# Altium schematic sheet PART1_filters.SchDoc: PART1_RC_filters
size A4
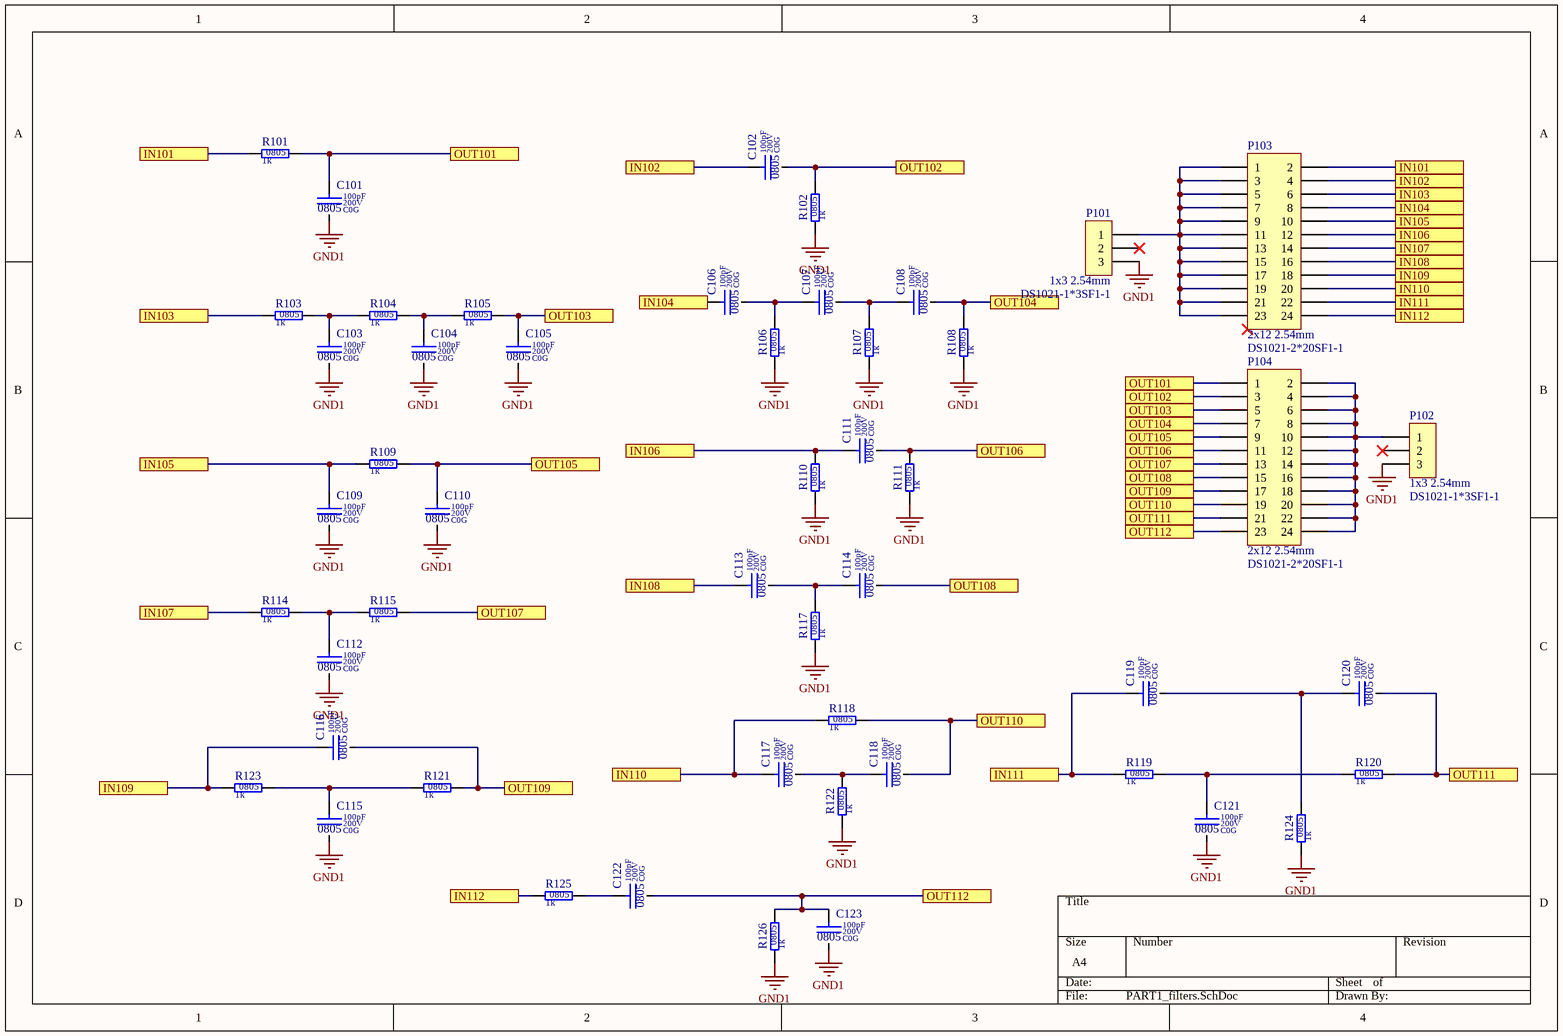
[diagram p0: PART1_filters.SchDoc]

## Parts
C101  value 100pF  Dielectric: C0G  Voltage: 200V  SCH_Footprint: 0805  [C_0805_2012]  (hidden comment: Ceramic C0G)
C102  value 100pF  Dielectric: C0G  Voltage: 200V  SCH_Footprint: 0805  [C_0805_2012]  (hidden comment: Ceramic C0G)
C103  value 100pF  Dielectric: C0G  Voltage: 200V  SCH_Footprint: 0805  [C_0805_2012]  (hidden comment: Ceramic C0G)
C104  value 100pF  Dielectric: C0G  Voltage: 200V  SCH_Footprint: 0805  [C_0805_2012]  (hidden comment: Ceramic C0G)
C105  value 100pF  Dielectric: C0G  Voltage: 200V  SCH_Footprint: 0805  [C_0805_2012]  (hidden comment: Ceramic C0G)
C106  value 100pF  Dielectric: C0G  Voltage: 200V  SCH_Footprint: 0805  [C_0805_2012]  (hidden comment: Ceramic C0G)
C107  value 100pF  Dielectric: C0G  Voltage: 200V  SCH_Footprint: 0805  [C_0805_2012]  (hidden comment: Ceramic C0G)
C108  value 100pF  Dielectric: C0G  Voltage: 200V  SCH_Footprint: 0805  [C_0805_2012]  (hidden comment: Ceramic C0G)
C109  value 100pF  Dielectric: C0G  Voltage: 200V  SCH_Footprint: 0805  [C_0805_2012]  (hidden comment: Ceramic C0G)
C110  value 100pF  Dielectric: C0G  Voltage: 200V  SCH_Footprint: 0805  [C_0805_2012]  (hidden comment: Ceramic C0G)
C111  value 100pF  Dielectric: C0G  Voltage: 200V  SCH_Footprint: 0805  [C_0805_2012]  (hidden comment: Ceramic C0G)
C112  value 100pF  Dielectric: C0G  Voltage: 200V  SCH_Footprint: 0805  [C_0805_2012]  (hidden comment: Ceramic C0G)
C113  value 100pF  Dielectric: C0G  Voltage: 200V  SCH_Footprint: 0805  [C_0805_2012]  (hidden comment: Ceramic C0G)
C114  value 100pF  Dielectric: C0G  Voltage: 200V  SCH_Footprint: 0805  [C_0805_2012]  (hidden comment: Ceramic C0G)
C115  value 100pF  Dielectric: C0G  Voltage: 200V  SCH_Footprint: 0805  [C_0805_2012]  (hidden comment: Ceramic C0G)
C116  value 100pF  Dielectric: C0G  Voltage: 200V  SCH_Footprint: 0805  [C_0805_2012]  (hidden comment: Ceramic C0G)
C117  value 100pF  Dielectric: C0G  Voltage: 200V  SCH_Footprint: 0805  [C_0805_2012]  (hidden comment: Ceramic C0G)
C118  value 100pF  Dielectric: C0G  Voltage: 200V  SCH_Footprint: 0805  [C_0805_2012]  (hidden comment: Ceramic C0G)
C119  value 100pF  Dielectric: C0G  Voltage: 200V  SCH_Footprint: 0805  [C_0805_2012]  (hidden comment: Ceramic C0G)
C120  value 100pF  Dielectric: C0G  Voltage: 200V  SCH_Footprint: 0805  [C_0805_2012]  (hidden comment: Ceramic C0G)
C121  value 100pF  Dielectric: C0G  Voltage: 200V  SCH_Footprint: 0805  [C_0805_2012]  (hidden comment: Ceramic C0G)
C122  value 100pF  Dielectric: C0G  Voltage: 200V  SCH_Footprint: 0805  [C_0805_2012]  (hidden comment: Ceramic C0G)
C123  value 100pF  Dielectric: C0G  Voltage: 200V  SCH_Footprint: 0805  [C_0805_2012]  (hidden comment: Ceramic C0G)
P101  value DS1021-1*3SF1-1  SCH_Footprint: 1x3 2.54mm  [P_HEADER_1x3_2.54]  (hidden comment: Goldpin)
P102  value DS1021-1*3SF1-1  SCH_Footprint: 1x3 2.54mm  [P_HEADER_1x3_2.54]  (hidden comment: Goldpin)
P103  value DS1021-2*20SF1-1  SCH_Footprint: 2x12 2.54mm  [P_HEADER_2x12_2.54]  (hidden comment: IN)
P104  value DS1021-2*20SF1-1  SCH_Footprint: 2x12 2.54mm  [P_HEADER_2x12_2.54]  (hidden comment: OUT)
R101  value 1k  SCH_Footprint: 0805  [R_0805_2012]  (hidden comment: Resistor)
R102  value 1k  SCH_Footprint: 0805  [R_0805_2012]  (hidden comment: Resistor)
R103  value 1k  SCH_Footprint: 0805  [R_0805_2012]  (hidden comment: Resistor)
R104  value 1k  SCH_Footprint: 0805  [R_0805_2012]  (hidden comment: Resistor)
R105  value 1k  SCH_Footprint: 0805  [R_0805_2012]  (hidden comment: Resistor)
R106  value 1k  SCH_Footprint: 0805  [R_0805_2012]  (hidden comment: Resistor)
R107  value 1k  SCH_Footprint: 0805  [R_0805_2012]  (hidden comment: Resistor)
R108  value 1k  SCH_Footprint: 0805  [R_0805_2012]  (hidden comment: Resistor)
R109  value 1k  SCH_Footprint: 0805  [R_0805_2012]  (hidden comment: Resistor)
R110  value 1k  SCH_Footprint: 0805  [R_0805_2012]  (hidden comment: Resistor)
R111  value 1k  SCH_Footprint: 0805  [R_0805_2012]  (hidden comment: Resistor)
R114  value 1k  SCH_Footprint: 0805  [R_0805_2012]  (hidden comment: Resistor)
R115  value 1k  SCH_Footprint: 0805  [R_0805_2012]  (hidden comment: Resistor)
R117  value 1k  SCH_Footprint: 0805  [R_0805_2012]  (hidden comment: Resistor)
R118  value 1k  SCH_Footprint: 0805  [R_0805_2012]  (hidden comment: Resistor)
R119  value 1k  SCH_Footprint: 0805  [R_0805_2012]  (hidden comment: Resistor)
R120  value 1k  SCH_Footprint: 0805  [R_0805_2012]  (hidden comment: Resistor)
R121  value 1k  SCH_Footprint: 0805  [R_0805_2012]  (hidden comment: Resistor)
R122  value 1k  SCH_Footprint: 0805  [R_0805_2012]  (hidden comment: Resistor)
R123  value 1k  SCH_Footprint: 0805  [R_0805_2012]  (hidden comment: Resistor)
R124  value 1k  SCH_Footprint: 0805  [R_0805_2012]  (hidden comment: Resistor)
R125  value 1k  SCH_Footprint: 0805  [R_0805_2012]  (hidden comment: Resistor)
R126  value 1k  SCH_Footprint: 0805  [R_0805_2012]  (hidden comment: Resistor)

## Ports
IN101, IN102, IN103, IN104, IN105, IN106, IN107, IN108, IN109, IN110, IN111, IN112, OUT101, OUT102, OUT103, OUT104, OUT105, OUT106, OUT107, OUT108, OUT109, OUT110, OUT111, OUT112

## Nets
GND1: C101.2 C103.2 C104.2 C105.2 C109.2 C110.2 C112.2 C115.2 C121.2 C123.2 P101.3 P102.3 R102.1 R106.1 R107.1 R108.1 R110.1 R111.1 R117.1 R122.1 R124.1 R126.1
IN101: P103.2 R101.1 ; port IN101
IN102: C102.1 P103.4 ; port IN102
IN103: P103.6 R103.1 ; port IN103
IN104: C106.1 P103.8 ; port IN104
IN105: C109.1 P103.10 R109.1 ; port IN105
IN106: C111.1 P103.12 R110.2 ; port IN106
IN107: P103.14 R114.1 ; port IN107
IN108: C113.1 P103.16 ; port IN108
IN109: C116.1 P103.18 R123.1 ; port IN109
IN110: C117.1 P103.20 R118.1 ; port IN110
IN111: C119.1 P103.22 R119.1 ; port IN111
IN112: P103.24 R125.1 ; port IN112
OUT101: C101.1 P104.1 R101.2 ; port OUT101
OUT102: C102.2 P104.3 R102.2 ; port OUT102
OUT103: C105.1 P104.5 R105.2 ; port OUT103
OUT104: C108.2 P104.7 R108.2 ; port OUT104
OUT105: C110.1 P104.9 R109.2 ; port OUT105
OUT106: C111.2 P104.11 R111.2 ; port OUT106
OUT107: P104.13 R115.2 ; port OUT107
OUT108: C114.2 P104.15 ; port OUT108
OUT109: C116.2 P104.17 R121.2 ; port OUT109
OUT110: C118.2 P104.19 R118.2 ; port OUT110
OUT111: C120.2 P104.21 R120.2 ; port OUT111
OUT112: C122.2 C123.1 P104.23 R126.2 ; port OUT112
NetC103_1: C103.1 R103.2 R104.1
NetC104_1: C104.1 R104.2 R105.1
NetC106_2: C106.2 C107.1 R106.2
NetC107_2: C107.2 C108.1 R107.2
NetC112_1: C112.1 R114.2 R115.1
NetC113_2: C113.2 C114.1 R117.2
NetC115_1: C115.1 R121.1 R123.2
NetC117_2: C117.2 C118.1 R122.2
NetC119_2: C119.2 C120.1 R124.2
NetC121_1: C121.1 R119.2 R120.1
NetC122_1: C122.1 R125.2
NetP101_1: P101.1 P103.1 P103.3 P103.5 P103.7 P103.9 P103.11 P103.13 P103.15 P103.17 P103.19 P103.21 P103.23
NetP102_1: P102.1 P104.2 P104.4 P104.6 P104.8 P104.10 P104.12 P104.14 P104.16 P104.18 P104.20 P104.22 P104.24

Not connected (* = marked no-connect by the designer): P101 2*; P102 2*

## Library data of the parts
C101-C123 = C_100pF_200V_C0G_0805_5: Capacitor; Manufacturer: KEMET; Manufacturer Part Number: C0805C101J2GACTU; Tolerance (%): 5; Part Number: C_100pF_200V_C0G_0805_5; HelpURL: http://www.tme.eu/pl/Document/a556da97341b52257167181ac42b746d/KEM_C1003_C0G_SMD.pdf; Supplier 1: TME; Supplier Part Number 1: C0805C101J2GAC; Supplier 2: RS Components; Supplier 3: Farnell; Supplier 4: Mouser; Supplier 5: Digi-Key
P101 P102 = P_HEADER_1x3_2.54: Pin Header; Manufacturer: Connfly; Part Number: P_HEADER_1x3_2.54; Component Type: Standard; HelpURL: http://www.tme.eu/en/Document/cc301e58a5da78cb543a94b5a5b7f06a/DS1021.pdf; Manufacturer Part Number: DS1021-1*3SF1-1; Supplier 1: TME; Supplier Part Number 1: ZL201-03G; Supplier 2: RS Components; Supplier 3: Farnell; Supplier 4: Mouser; Supplier 5: Digi-Key
P103 P104 = P_HEADER_2x12_2.54: Pin Header; Manufacturer: Connfly; Part Number: P_HEADER_2x12_2.54; Component Type: Standard; HelpURL: https://www.tme.eu/Document/cc301e58a5da78cb543a94b5a5b7f06a/DS1021.pdf; Manufacturer Part Number: DS1021-2*20SF1-1; Supplier 1: TME; Supplier Part Number 1: ZL202-40G; Supplier 2: RS Components; Supplier 3: Farnell; Supplier 4: Mouser; Supplier 5: Digi-Key
R101-R111 R114 R115 R117-R126 = R_1k_0805_1: Manufacturer: Royalohm; Manufacturer Part Number: HP05W3F1001T5E; Voltage: 150V; Power: 300mW; Tolerance: 1%; Part Number: R_1k_0805_1; HelpURL: https://www.tme.eu/pl/Document/63d5a2fbb689d2d511047d7cc8640cd8/chip_resistor_hp.pdf; Supplier 1: TME; Supplier Part Number 1: HP05-1K1%; Supplier 2: RS Components; Supplier 3: Farnell; Supplier 4: Mouser; Supplier 5: Digi-Key